# EAGLE design Four_Track_R1 (EAGLE 9.6.2)
TITLE: Four Track
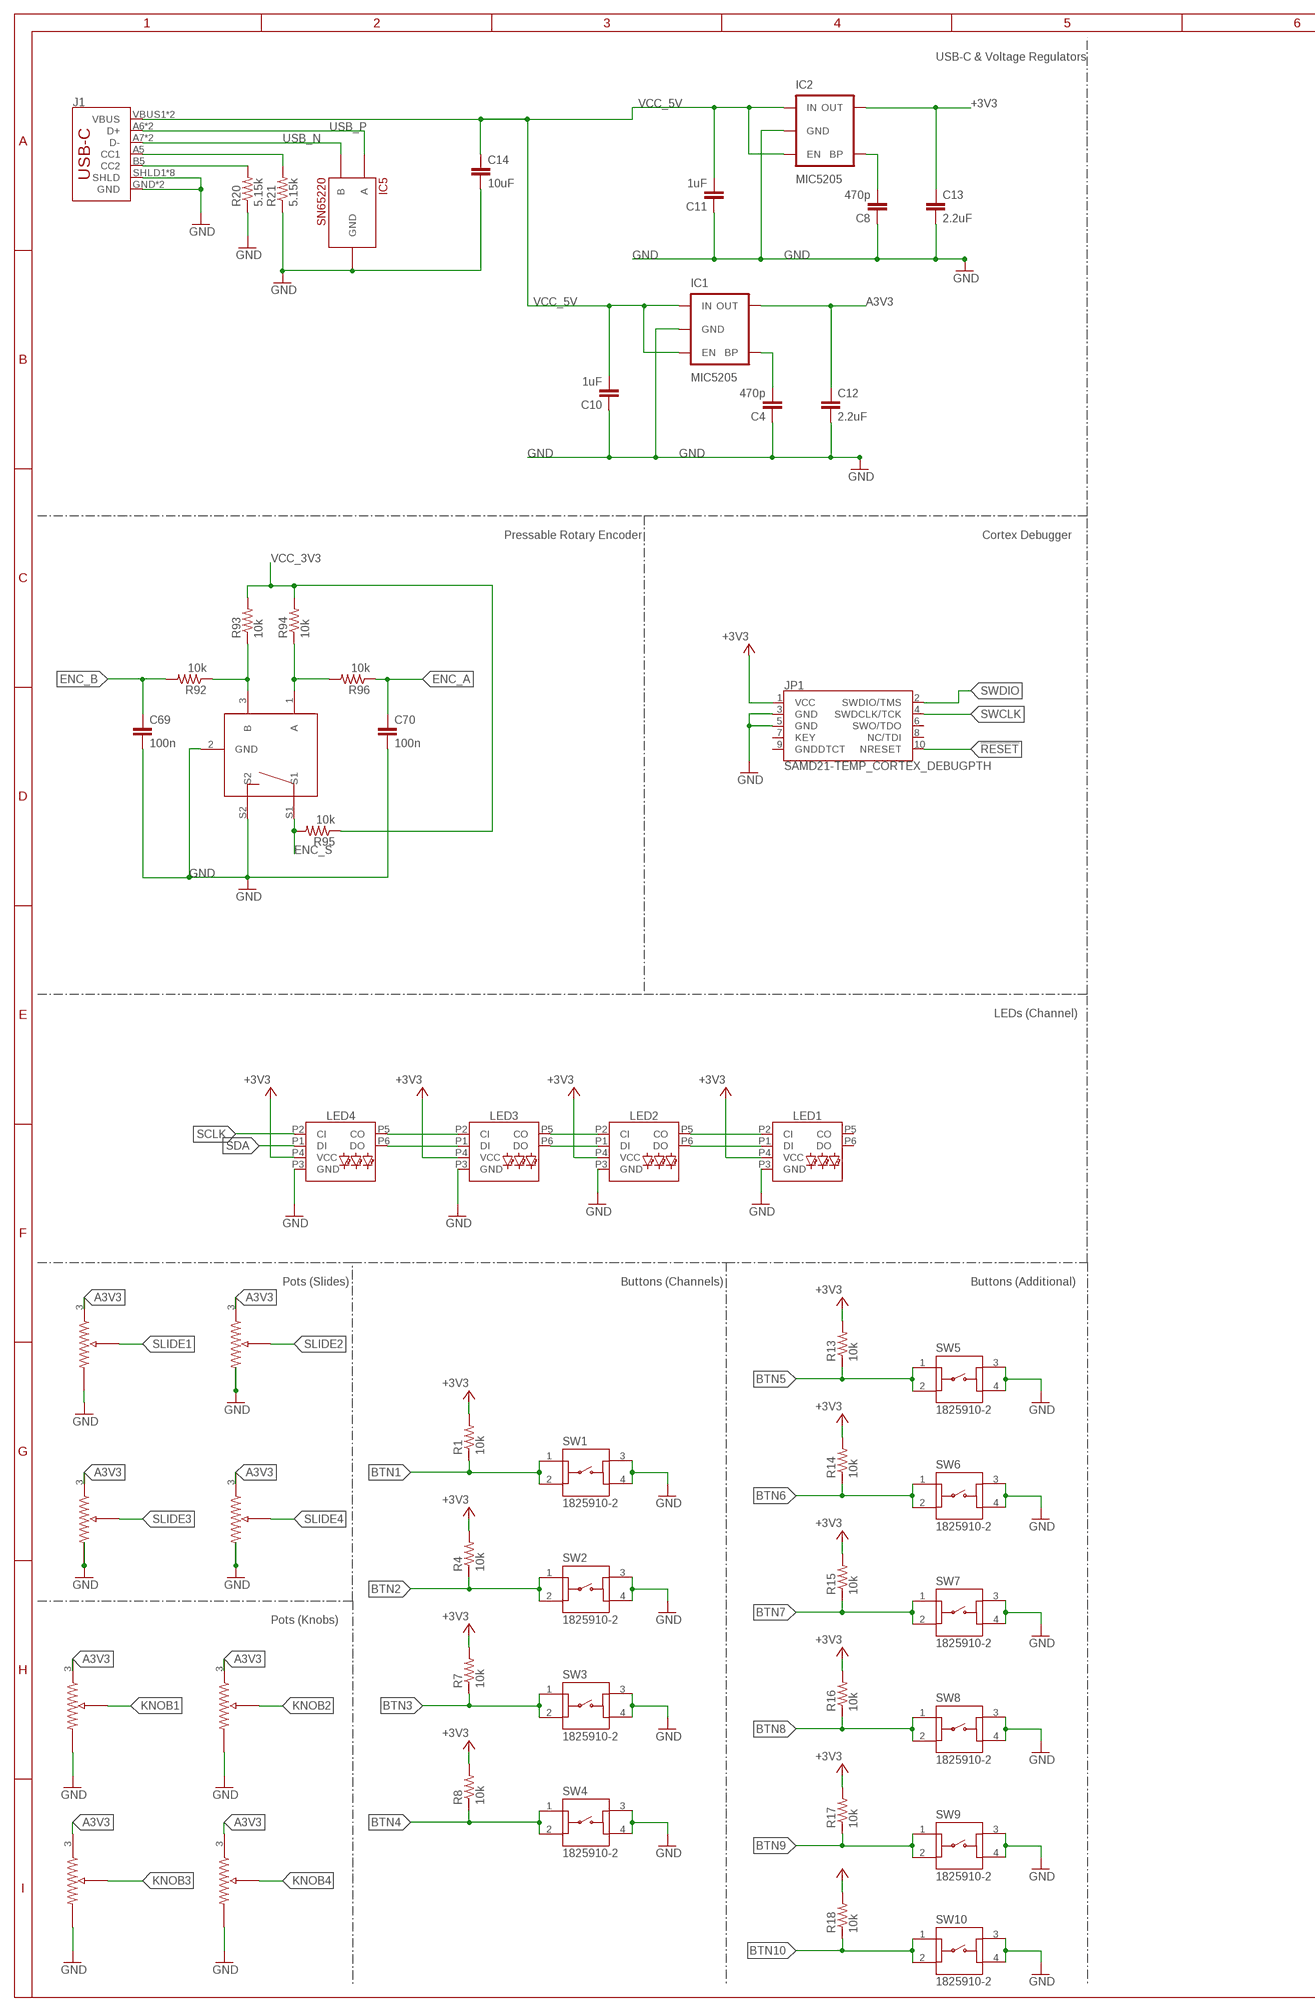
[diagram p0: schematic, sheet 1, part 1 of 2]
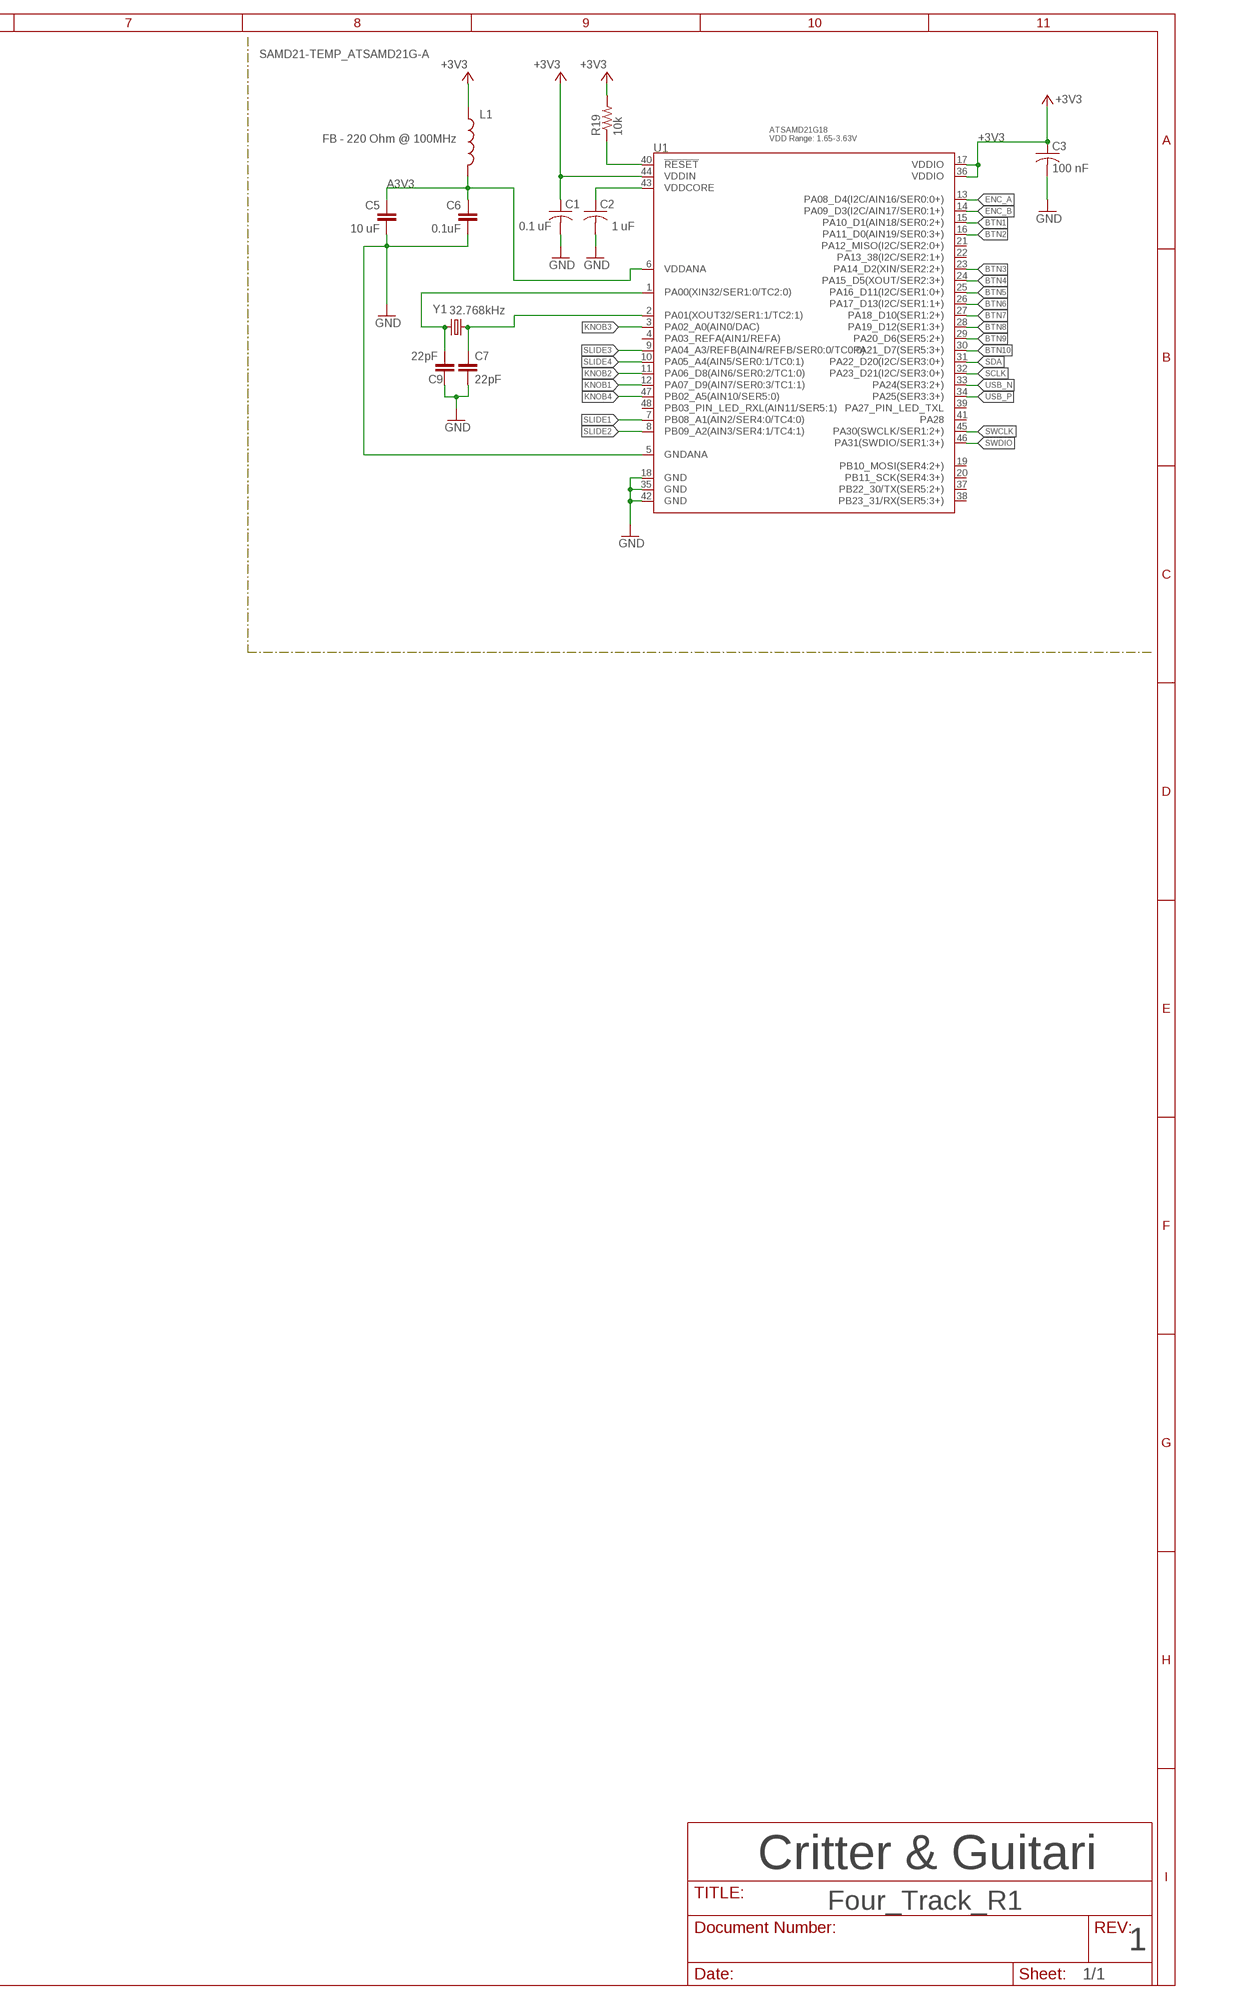
[diagram p1: schematic, sheet 1, part 2 of 2]

## Parts
C1  0.1 uF  C-USC0603  [C0603]
C2  1 uF  C-USC0603  [C0603]
C3  100 nF  C-USC0603  [C0603]
C4  470p  CAP0603-CAP  [0603-CAP]
C5  10 uF  0.1UF-25V(+80/-20%)(0603)  [0603-CAP]
C6  0.1uF  0.1UF-25V(+80/-20%)(0603)  [0603-CAP]
C7  22pF  15PF-50V-5%(0603)  [0603-CAP]
C8  470p  CAP0603-CAP  [0603-CAP]
C9  22pF  15PF-50V-5%(0603)  [0603-CAP]
C10  1uF  CAP0603-CAP  [0603-CAP]
C11  1uF  CAP0603-CAP  [0603-CAP]
C12  2.2uF  C-EUC0805  [C0805]
C13  2.2uF  C-EUC0805  [C0805]
C14  10uF  C-EUC1206  [C1206]
C69  100n  CAP0603-CAP  [0603-CAP]
C70  100n  CAP0603-CAP  [0603-CAP]
IC1  MIC5205  V_REG_LDOSMD  [SPARKFUN-3-2-07_SOT23-5]
IC2  MIC5205  V_REG_LDOSMD  [SPARKFUN-3-2-07_SOT23-5]
IC5  SN65220  [SOT23-6L]
J1  SPARKFUN-CONNECTORS_USB_C16PIN  [SPARKFUN-CONNECTORS_USB-C-16P]
JP1  SAMD21-TEMP_CORTEX_DEBUGPTH  [SAMD21-TEMP_2X5-PTH-1.27MM]
L1  FB - 220 Ohm @ 100MHz  INDUCTOR0603  [0603]
LED1  SPARKFUN-LED_APA102-5050  [SPARKFUN-LED_APA102-5050]
LED2  SPARKFUN-LED_APA102-5050  [SPARKFUN-LED_APA102-5050]
LED3  SPARKFUN-LED_APA102-5050  [SPARKFUN-LED_APA102-5050]
LED4  SPARKFUN-LED_APA102-5050  [SPARKFUN-LED_APA102-5050]
R1  10k  R-US_R0603  [R0603]
R2  POTPTA45  [SLIDE_POT_PTA4543]
R3  POTPTA45  [SLIDE_POT_PTA4543]
R4  10k  R-US_R0603  [R0603]
R5  POTPTA45  [SLIDE_POT_PTA4543]
R6  POTVERT  [POT-P09X-VERT]
R7  10k  R-US_R0603  [R0603]
R8  10k  R-US_R0603  [R0603]
R9  POTVERT  [POT-P09X-VERT]
R10  POTVERT  [POT-P09X-VERT]
R11  POTPTA45  [SLIDE_POT_PTA4543]
R12  POTVERT  [POT-P09X-VERT]
R13  10k  R-US_R0603  [R0603]
R14  10k  R-US_R0603  [R0603]
R15  10k  R-US_R0603  [R0603]
R16  10k  R-US_R0603  [R0603]
R17  10k  R-US_R0603  [R0603]
R18  10k  R-US_R0603  [R0603]
R19  10k  R-US_R0603  [R0603]
R20  5.15k  R-US_R0603  [R0603]
R21  5.15k  R-US_R0603  [R0603]
R92  10k  RESISTOR0603-RES  [0603-RES]
R93  10k  RESISTOR0603-RES  [0603-RES]
R94  10k  RESISTOR0603-RES  [0603-RES]
R95  10k  RESISTOR0603-RES  [0603-RES]
R96  10k  RESISTOR0603-RES  [0603-RES]
S3  ENCODER_SWITCH  [ENCODER_SWITCH]
SW1  1825910-2  [TE_1825910-2]
SW2  1825910-2  [TE_1825910-2]
SW3  1825910-2  [TE_1825910-2]
SW4  1825910-2  [TE_1825910-2]
SW5  1825910-2  [TE_1825910-2]
SW6  1825910-2  [TE_1825910-2]
SW7  1825910-2  [TE_1825910-2]
SW8  1825910-2  [TE_1825910-2]
SW9  1825910-2  [TE_1825910-2]
SW10  1825910-2  [TE_1825910-2]
U1  SAMD21-TEMP_ATSAMD21G-A  [SAMD21-TEMP_TQFP-48]
Y1  32.768kHz  CRYSTAL3.2X1.5MM  [CRYSTAL-SMD-3.2X1.5MM]

## Nets
!RESET: JP1.10(NRESET) R19.1 U1.40(!RESET!)
+3V3: C1.1 C3.1 C13.1 IC2.5(OUT) JP1.1(VCC) L1.1 LED1.P4(VCC) LED2.P4(VCC) LED3.P4(VCC) LED4.P4(VCC) R1.2 R4.2 R7.2 R8.2 R13.2 R14.2 R15.2 R16.2 R17.2 R18.2 R19.2 U1.17(VDDIO) U1.36(VDDIO) U1.44(VDDIN)
A3V3: C5.1 C6.1 C12.1 IC1.5(OUT) L1.2 R2.3 R3.3 R5.3 R6.3 R9.3 R10.3 R11.3 R12.3 U1.6(VDDANA)
BTN1 [Digital IO]: R1.1 SW1.1 SW1.2 U1.15(PA10_D1(AIN18/SER0:2+))
BTN2 [Digital IO]: R4.1 SW2.1 SW2.2 U1.16(PA11_D0(AIN19/SER0:3+))
BTN3 [Digital IO]: R7.1 SW3.1 SW3.2 U1.23(PA14_D2(XIN/SER2:2+))
BTN4: R8.1 SW4.1 SW4.2 U1.24(PA15_D5(XOUT/SER2:3+))
BTN5 [Digital IO]: R13.1 SW5.1 SW5.2 U1.25(PA16_D11(I2C/SER1:0+))
BTN6: R14.1 SW6.1 SW6.2 U1.26(PA17_D13(I2C/SER1:1+))
BTN7 [Digital IO]: R15.1 SW7.1 SW7.2 U1.27(PA18_D10(SER1:2+))
BTN8 [Digital IO]: R16.1 SW8.1 SW8.2 U1.28(PA19_D12(SER1:3+))
BTN9 [Digital IO]: R17.1 SW9.1 SW9.2 U1.29(PA20_D6(SER5:2+))
BTN10 [Digital IO]: R18.1 SW10.1 SW10.2 U1.30(PA21_D7(SER5:3+))
ENC_A: C70.1 R96.1 U1.13(PA08_D4(I2C/AIN16/SER0:0+))
ENC_B: C69.1 R92.2 U1.14(PA09_D3(I2C/AIN17/SER0:1+))
ENC_S: R95.2 S3.S1
GND: C1.2 C2.2 C3.2 C4.1 C5.2 C6.2 C7.2 C8.1 C9.1 C10.1 C11.1 C12.2 C13.2 C14.2 C69.2 C70.2 IC1.2(GND) IC2.2(GND) IC5.2(GND) IC5.5(GND) J1.GND J1.GND2(GND) J1.SHLD1(SHLD) J1.SHLD2(SHLD) J1.SHLD3(SHLD) J1.SHLD4(SHLD) J1.SHLD5(SHLD) J1.SHLD6(SHLD) J1.SHLD7(SHLD) J1.SHLD8(SHLD) JP1.3(GND) JP1.5(GND) LED1.P3(GND) LED2.P3(GND) LED3.P3(GND) LED4.P3(GND) R2.1 R3.1 R5.1 R6.1 R9.1 R10.1 R11.1 R12.1 R20.1 R21.1 S3.2(GND) S3.S2 SW1.3 SW1.4 SW2.3 SW2.4 SW3.3 SW3.4 SW4.3 SW4.4 SW5.3 SW5.4 SW6.3 SW6.4 SW7.3 SW7.4 SW8.3 SW8.4 SW9.3 SW9.4 SW10.3 SW10.4 U1.5(GNDANA) U1.18(GND) U1.35(GND) U1.42(GND)
KNOB1 [Digital IO]: R6.WIPER U1.12(PA07_D9(AIN7/SER0:3/TC1:1))
KNOB2 [Digital IO]: R12.WIPER U1.11(PA06_D8(AIN6/SER0:2/TC1:0))
KNOB3 [power]: R9.WIPER U1.3(PA02_A0(AIN0/DAC))
KNOB4 [power]: R10.WIPER U1.47(PB02_A5(AIN10/SER5:0))
N$1: J1.B5(CC2) R20.2
N$2: LED3.P2(CI) LED4.P5(CO)
N$3: LED3.P1(DI) LED4.P6(DO)
N$4: LED2.P1(DI) LED3.P6(DO)
N$5: LED2.P2(CI) LED3.P5(CO)
N$6: LED1.P1(DI) LED2.P6(DO)
N$7: LED1.P2(CI) LED2.P5(CO)
N$8: J1.A5(CC1) R21.2
N$9: C4.2 IC1.4(BP)
N$10: C8.2 IC2.4(BP)
N$11: C7.1 U1.2(PA01(XOUT32/SER1:1/TC2:1)) Y1.P$1
N$12: C9.2 U1.1(PA00(XIN32/SER1:0/TC2:0)) Y1.P$2
N$16: R92.1 R93.1 S3.3(B)
N$21: R94.1 R96.2 S3.1(A)
SCLK: LED4.P2(CI) U1.32(PA23_D21(I2C/SER3:0+))
SDA: LED4.P1(DI) U1.31(PA22_D20(I2C/SER3:0+))
SLIDE1 [power]: R11.2 U1.7(PB08_A1(AIN2/SER4:0/TC4:0))
SLIDE2 [power]: R5.2 U1.8(PB09_A2(AIN3/SER4:1/TC4:1))
SLIDE3 [power]: R2.2 U1.9(PA04_A3/REFB(AIN4/REFB/SER0:0/TC0:0))
SLIDE4 [power]: R3.2 U1.10(PA05_A4(AIN5/SER0:1/TC0:1))
SWCLK: JP1.4(SWDCLK/TCK) U1.45(PA30(SWCLK/SER1:2+))
SWDIO: JP1.2(SWDIO/TMS) U1.46(PA31(SWDIO/SER1:3+))
USB_N: IC5.4(B) J1.A7(D-) J1.B7(D-) U1.33(PA24(SER3:2+))
USB_P: IC5.6(A) J1.A6(D+) J1.B6(D+) U1.34(PA25(SER3:3+))
VCC_3V3: R93.2 R94.2 R95.1
VCC_5V: C10.2 C11.2 C14.1 IC1.1(IN) IC1.3(EN) IC2.1(IN) IC2.3(EN) J1.VBUS1(VBUS) J1.VBUS2(VBUS)
VDDCORE: C2.1 U1.43(VDDCORE)
Unconnected: JP1.6(SWO/TDO) JP1.7(KEY) JP1.8(NC/TDI) JP1.9(GNDDTCT) LED1.P5(CO) LED1.P6(DO) U1.4(PA03_REFA(AIN1/REFA)) U1.19(PB10_MOSI(SER4:2+)) U1.20(PB11_SCK(SER4:3+)) U1.21(PA12_MISO(I2C/SER2:0+)) U1.22(PA13_38(I2C/SER2:1+)) U1.37(PB22_30/TX(SER5:2+)) U1.38(PB23_31/RX(SER5:3+)) U1.39(PA27_PIN_LED_TXL) U1.41(PA28) U1.48(PB03_PIN_LED_RXL(AIN11/SER5:1))

## Notes on the sheet
- USB-C & Voltage Regulators
- ATSAMD21G18
  VDD Range: 1.65-3.63V
- Pressable Rotary Encoder | Cortex Debugger
- LEDs (Channel)
- Pots (Slides) | Buttons (Channels) | Buttons (Additional)
- Pots (Knobs)
- Critter & Guitari
- 1

## Library data of the parts
C1-C3 = rcl:C-US: CAPACITOR, American symbol; CID: 67; SPICEPREFIX: C
C4 C8 = osborn:CAP: Capacitor Standard 0603 ceramic capacitor, and 0.1" leaded capacitor.; CID: 111
C5 = SparkFun-Capacitors:0.1UF-25V(+80/-20%)(0603): CAP-00810 Ceramic Standard decoupling cap; CID: 366; PROD_ID: CAP-00810; VALUE: 0.1uF
C6 = SparkFun-Capacitors:0.1UF-25V(+80/-20%)(0603): CAP-00810 Ceramic Standard decoupling cap; CID: 67; PROD_ID: CAP-00810
C7 C9 = SparkFun-Capacitors:15PF-50V-5%(0603): CAP-07881; CID: 106; PROD_ID: CAP-07881; VALUE: 15pF
C10 C11 = osborn:CAP: Capacitor Standard 0603 ceramic capacitor, and 0.1" leaded capacitor.; CID: 73
C12-C14 = rcl:C-EU: CAPACITOR, European symbol; CID: 428; SPICEPREFIX: C
C69 C70 = osborn:CAP: Capacitor Standard 0603 ceramic capacitor, and 0.1" leaded capacitor.; CID: 67
IC1 IC2 = osborn:V_REG_LDO: Voltage Regulator LDO Standard 150mA LDO voltage regulator in SOT-23 layout. Micrel part MIC5205. BP (by-pass) pin is used to lower output noise with 470pF cap.; CID: 146
IC5 = osborn:SN65220; CID: 314
J1 = USB-C-Breakout:SPARKFUN-CONNECTORS_USB_C: USB Type C 16Pin Connector Super Speed pins not available on the 16-pin purely SMD connector so this part is best for USB 2.0 implementations. D1 and D2 are tied together enabling D+/- no matter which way the cable is plugged into the connector. The two channel configuration pins (CC1/2) are exposed. These are normally connected to ground via 5.1k resistors but can be reconfigured for high current/high power applications.; CID: 449; PROD_ID: CONN-14122
JP1 = Debugger:SAMD21-TEMP_CORTEX_DEBUG: Cortex Debug Connector Datasheet <http://infocenter.arm.com/help/topic/com.arm.doc.faqs/attached/13634/cortex_debug_connectors.pdf>; CID: 450
L1 = SparkFun-Passives:INDUCTOR: Inductors Basic Inductor/Choke - 0603 and 1206. Footprints are not proven and vary greatly between part numbers. INDUCTOR POWER 3.3UH 4.0A SMD 0.197" L x 0.197" W x 0.177" H (5.00mm x 5.00mm x 4.50mm); CID: 452; PROD_ID: RES-07859
LED1-LED4 = LED_APA102-2020:SPARKFUN-LED_APA102: APA102 Addressable RGB LED Used in manufacturing of various products at SparkFun Packages: 5050 2020 SparkFun Products: SparkFun Lumenati Boards <https://www.sparkfun.com/categories/405>; CID: 445; PROD_ID: DIO-13739
R1 R4 R7 R8 R13-R21 = rcl:R-US_: RESISTOR, American symbol; CID: 69; SPICEPREFIX: R
R2 R3 R5 R11 = osborn:POT; CID: 444
R6 R9 R10 R12 = osborn:POT; CID: 161
R92-R96 = osborn:RESISTOR: Resistor Basic schematic elements and footprints for 0603, 1206, and PTH resistors.; CID: 69; SUPPLIER: none
S3 = osborn:ENCODER_SWITCH; CID: 197; SPICEPREFIX: X
SW1-SW10 = Switches:1825910-2: SWITCH TACTILE SPST-NO 0.05A 24V Check prices <https://pricing.snapeda.com/parts/1825910-2/TE%20Connectivity/view-part?ref=eda>; AVAILABILITY: In Stock; CID: 446; COMMENT: 1825910-2; CONFIGURATION_POLE-THROW: Single Pole - Single Throw; CONTACT_CURRENT_RATING: 50 mA; DESCRIPTION: 50 mA SPST Round Actuator 160 Gram Force Tactile Pushbutton Switch; EU_ROHS_COMPLIANCE: Compliant; MF: TE Connectivity; MP: 1825910-2; PACKAGE: None; PRICE: None; PURCHASE-URL: https://pricing.snapeda.com/search/part/1825910-2/?ref=eda
U1 = sparkfun-samd21-pro-breakout-v10:SAMD21-TEMP_ATSAMD21G: Atmel SAMD21G SMART ARM-Based Microcontroller 7_21_21 Note: The symbo for the SAM21 has been updated to include added description for the Arduino pinout implementing the Sparkfun SAMD Board. The format is as follows: SAMDRegisterPin_ArduinoPin(Capabilities/Description); e.g. PB08_A5(AIN6/SER0:1/TC0:1). See https://cdn.sparkfun.com/assets/learn_tutorials/4/5/4/graphicalDatasheet-Dev.pdf The Atmel ® | SMART ™ SAM D21 is a series of low-power microcontrollers using the 32-bit ARM ® Cortex ® -M0+ processor, and ranging from 32- to 64-pins with up to 256KB Flash and 32KB of SRAM. The SAM D21 devices operate at a maximum frequency of 48MHz and reach 2.46 CoreMark/MHz. They are designed for simple and intuitive migration with identical peripheral modules, hex compatible code, identical linear address map and pin compatible migration paths between all devices in the product series. All devices include intelligent and flexible peripherals, Atmel Event System for inter-peripheral signaling, and support for capacitive touch button, slider and wheel user interfaces.; CID: 448; PROD_ID: IC-13064
Y1 = samd21-temp:CRYSTAL: Various standard crystals. Proven footprints.; CID: 451; PROD_ID: XTAL-13062

## Net classes
0 default: width 0.203 mm
1 power: width 0.203 mm

## Board
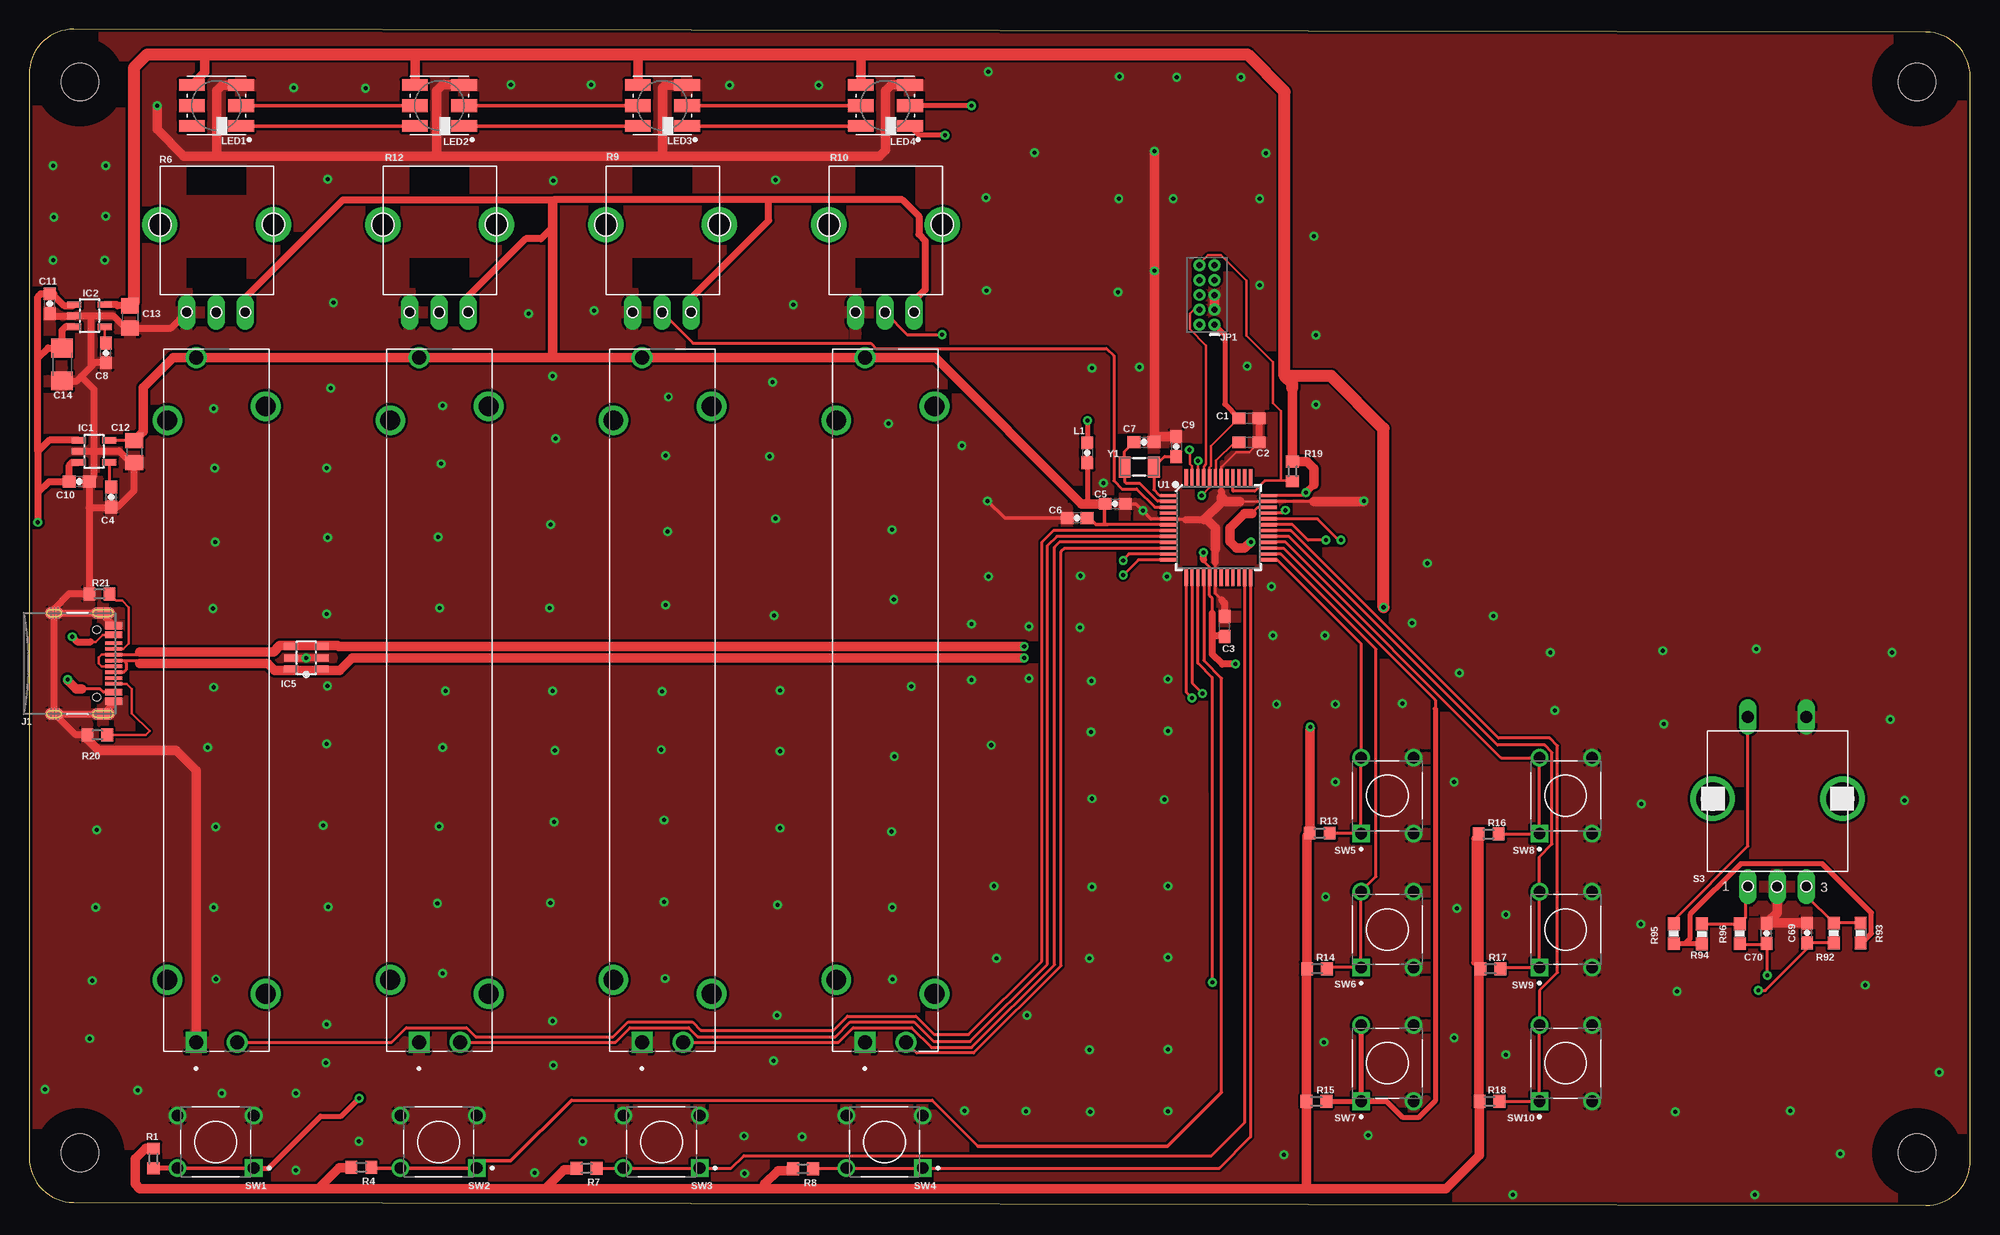
[diagram p2: board, top side]
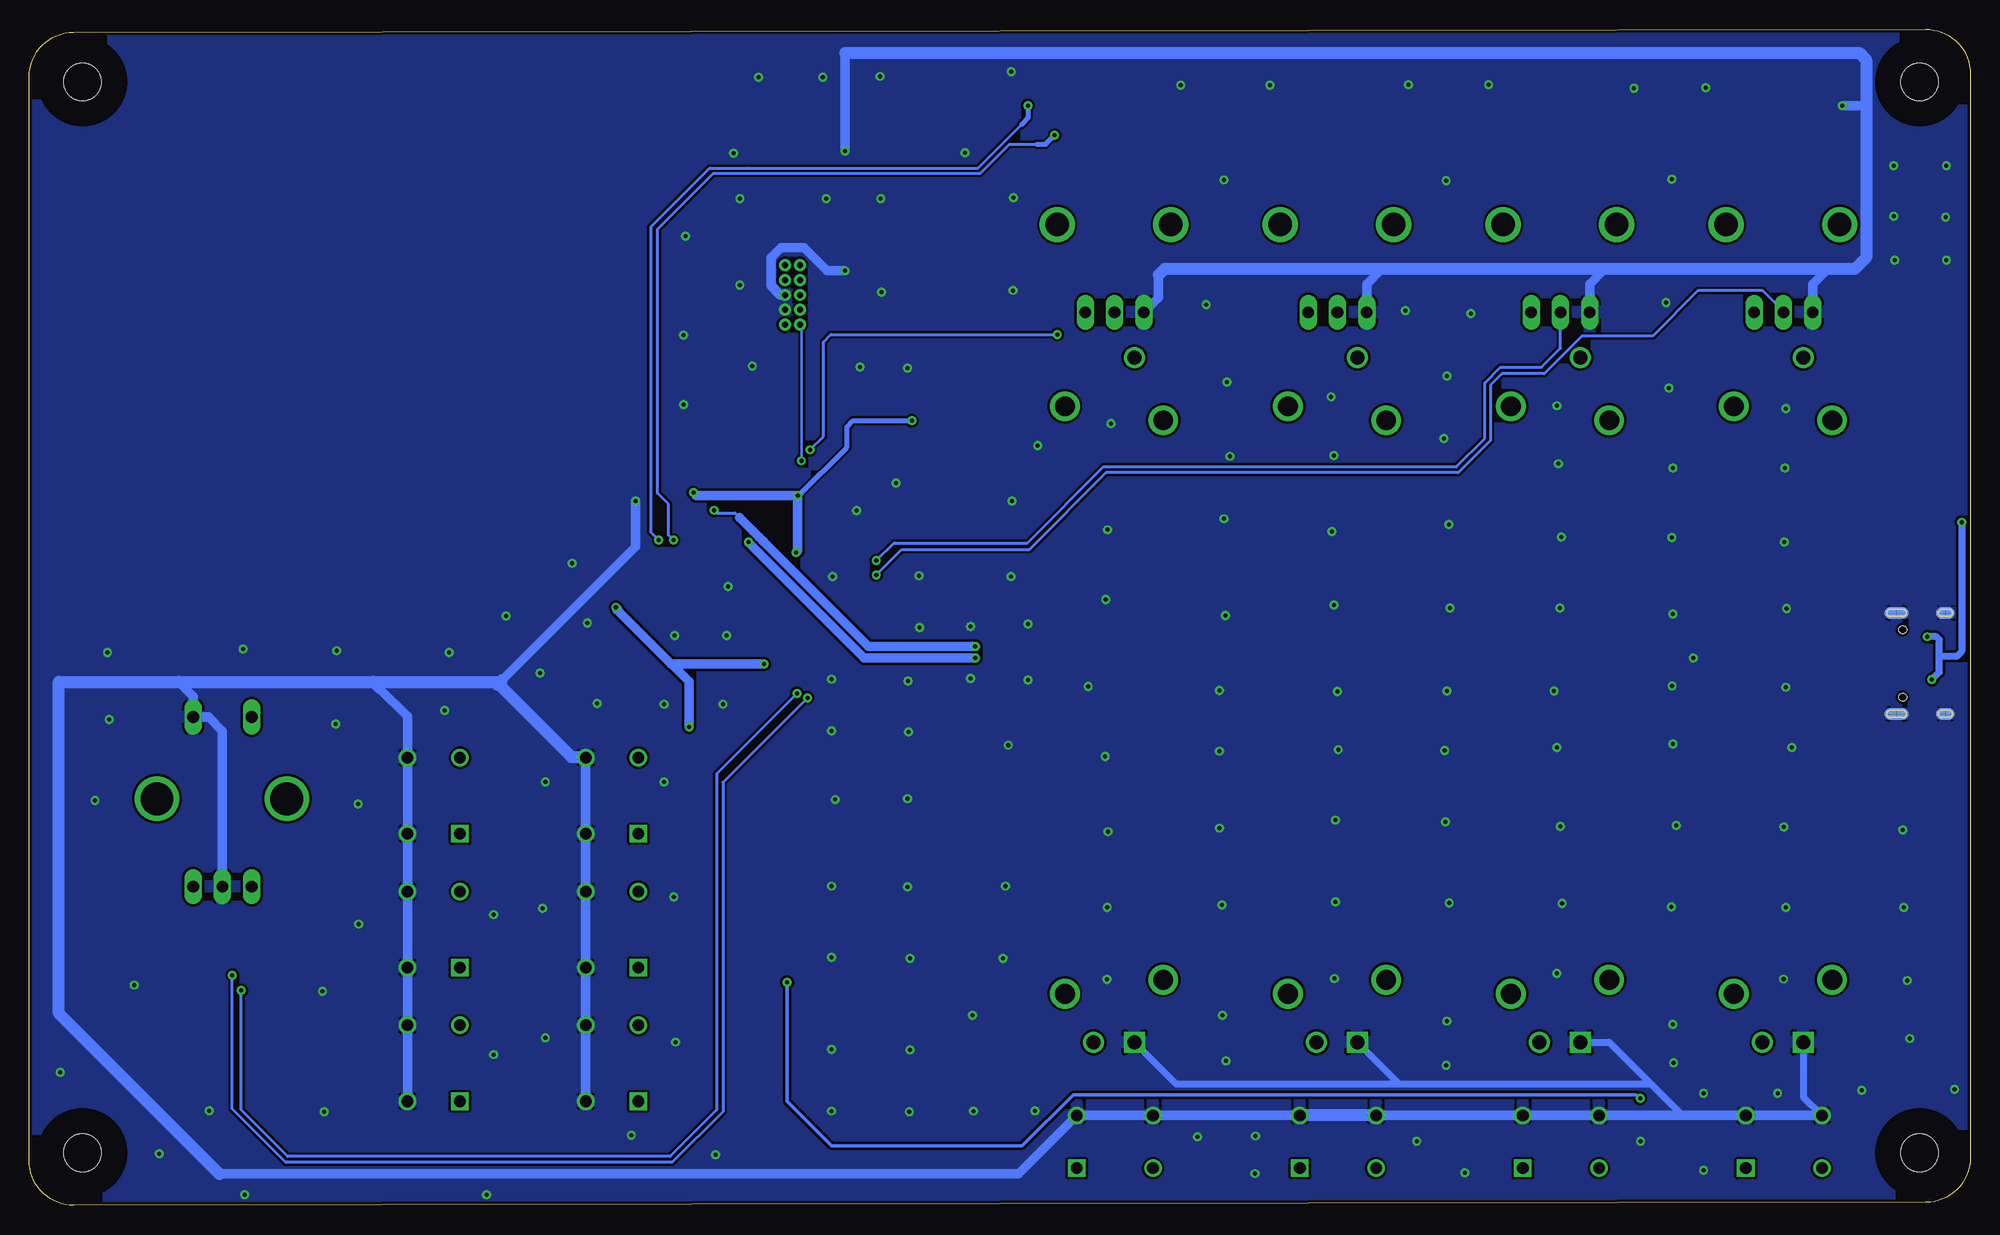
[diagram p3: board, bottom side, seen from below]

Size 165.84 x 100.5 mm. Coordinates in mm from the lower left corner, seen from the top.
Outline: 0,96.69 0,4.05 arc90 3.8,0.24 162.03,0 arc90 165.84,3.81 165.84,96.44 arc90 162.04,100.25 3.82,100.5 arc90 0,96.69
Copper layers (1*16): Top 0.035mm / dielectric 0.5mm / Bottom 0.035mm
Design rules "default *": minimum track width 8mil, minimum drill 0.35mm, track to track 8mil, track to pad 8mil, pad to pad 8mil, via to via 8mil, smd to smd 8mil, copper to edge 10mil, drill to drill 6mil, minimum pad ring 10mil, minimum via ring 8mil, stop-mask expansion 4mil, vias tented up to drill 0mil, thermal gap 8mil

### Footprints (pad centres in the part's own frame; a part is rotated, then mirrored left to right if it is on the bottom)
C0603 = smd 1.1 x 1: 1 -0.85,0; 2 0.85,0
0603-CAP = smd 1.1 x 1: 1 -0.85,0; 2 0.85,0
C0805 = smd 1.3 x 1.5: 1 -0.95,0; 2 0.95,0
C1206 = smd 1.6 x 1.8: 1 -1.4,0; 2 1.4,0
INSULATED_HOLE = hole 3.2: 0,0
SPARKFUN-3-2-07_SOT23-5 = smd 0.55 x 1.2: 1 -0.95,-1.3; 2 0,-1.3; 3 0.95,-1.3; 4 0.95,1.3; 5 -0.95,1.3
SOT23-6L = smd 0.6 x 1.2: 1 -0.95,-1.3; 2 0,-1.3; 3 0.95,-1.3; 4 0.95,1.3; 5 0,1.3; 6 -0.95,1.3
SPARKFUN-CONNECTORS_USB-C-16P = smd 0.3 x 1.45: A5 -1.25,0; A6 -0.25,0; A7 0.25,0; A8 1.25,0; B5 1.75,0; B6 0.75,0; B7 -0.75,0; B8 -1.75,0 | smd 0.6 x 1.45: GND -3.225,0; GND2 3.225,0 | smd 1 x 2.1: SHLD1 -4.32,-0.915; SHLD2 4.32,-0.915 | smd 1 x 2.1 bottom: SHLD3 -4.32,-0.915; SHLD4 4.32,-0.915 | smd 1 x 1.6: SHLD5 -4.32,-5.095; SHLD8 4.32,-5.095 | smd 1 x 1.6 bottom: SHLD6 -4.32,-5.095; SHLD7 4.32,-5.095 | smd 0.55 x 1.45: VBUS1 -2.45,0; VBUS2 2.45,0 | hole 0.65: -2.89,-1.445; 2.89,-1.445
SAMD21-TEMP_2X5-PTH-1.27MM = drill 0.508 pad 1: 1 -2.54,-0.635; 2 -2.54,0.635; 3 -1.27,-0.635; 4 -1.27,0.635; 5 0,-0.635; 6 0,0.635; 7 1.27,-0.635; 8 1.27,0.635; 9 2.54,-0.635; 10 2.54,0.635
0603 = smd 1.1 x 1: 1 -0.85,0; 2 0.85,0
SPARKFUN-LED_APA102-5050 = smd 1 x 2.2: P1 -1.75,-2.1; P3 1.75,-2.1; P4 1.75,2.1; P6 -1.75,2.1 | smd 1.1 x 2.2: P2 0,-2.1; P5 0,2.1
R0603 = smd 1 x 1.1: 1 -0.85,0; 2 0.85,0
SLIDE_POT_PTA4543 = drill 1.2 square: 1 -29.25,1.75 | drill 1.2: 2 -29.25,-1.75; 3 29.25,1.75 | drill 1.7: P1 -23.9,4.2; P2 23.9,4.2; P3 -25.1,-4.2; P4 25.1,-4.2
POT-P09X-VERT = drill 1 pad 1.27 long: 1 -2.54,-7.51; 3 2.46,-7.51; WIPER -0.04,-7.51 | drill 2 pad 2.54: P$4 4.86,-0.01; P$5 -4.84,-0.01
0603-RES = smd 1.1 x 1: 1 -0.85,0; 2 0.85,0
ENCODER_SWITCH = drill 1 pad 1.27 long: 1 -2.54,-7.51; 2 -0.04,-7.51; 3 2.46,-7.51; S1 -2.54,6.99; S2 2.46,6.99 | drill 2.8: P$4 5.56,-0.01; P$5 -5.54,-0.01
TE_1825910-2 = drill 0.99 square: 1 0,0 | drill 0.99: 2 6.5,0; 3 0,-4.5; 4 6.5,-4.5
SAMD21-TEMP_TQFP-48 = smd 1.5 x 0.28: 1 -4.25,2.75; 2 -4.25,2.25; 3 -4.25,1.75; 4 -4.25,1.25; 5 -4.25,0.75; 6 -4.25,0.25; 7 -4.25,-0.25; 8 -4.25,-0.75; 9 -4.25,-1.25; 10 -4.25,-1.75; 11 -4.25,-2.25; 12 -4.25,-2.75; 25 4.25,-2.75; 26 4.25,-2.25; 27 4.25,-1.75; 28 4.25,-1.25; 29 4.25,-0.75; 30 4.25,-0.25; 31 4.25,0.25; 32 4.25,0.75; 33 4.25,1.25; 34 4.25,1.75; 35 4.25,2.25; 36 4.25,2.75 | smd 0.28 x 1.5: 13 -2.75,-4.25; 14 -2.25,-4.25; 15 -1.75,-4.25; 16 -1.25,-4.25; 17 -0.75,-4.25; 18 -0.25,-4.25; 19 0.25,-4.25; 20 0.75,-4.25; 21 1.25,-4.25; 22 1.75,-4.25; 23 2.25,-4.25; 24 2.75,-4.25; 37 2.75,4.25; 38 2.25,4.25; 39 1.75,4.25; 40 1.25,4.25; 41 0.75,4.25; 42 0.25,4.25; 43 -0.25,4.25; 44 -0.75,4.25; 45 -1.25,4.25; 46 -1.75,4.25; 47 -2.25,4.25; 48 -2.75,4.25
CRYSTAL-SMD-3.2X1.5MM = smd 1 x 1.8: P$1 -1.25,0; P$2 1.25,0

### Placement (x,y rotation side)
C1  104.22,67.25 0 top
C2  104.22,65.2 0 top
C3  102.13,49.45 90 top
C4  7.01,60.52 90 top
C5  92.79,59.94 0 top
C6  89.53,58.72 180 top
C7  95.25,65.22 0 top
C8  6.55,72.84 90 top
C9  97.99,64.84 270 top
C10  4.27,61.84 180 top
C11  1.75,77.03 90 top
C12  8.97,64.41 270 top
C13  8.61,75.91 270 top
C14  2.79,71.85 270 top
C69  151.89,23.26 90 top
C70  148.44,23.24 90 top
H$1  [INSULATED_HOLE]  4.32,96.01 0 top
IC1  5.54,64.43 270 top
IC2  5.16,76.02 270 top
IC5  23.67,46.78 90 top
J1  7.21,46.3 270 top
JP1  100.63,77.79 90 top
L1  90.4,64.31 270 top
LED1  16,93.97 90 top
LED2  35.05,93.97 90 top
LED3  54.1,93.97 90 top
LED4  73.15,93.97 90 top
R1  10.62,4.01 90 top
R2  54.1,43.17 90 top
R3  73.15,43.17 90 top
R4  28.37,3.25 180 top
R5  35.05,43.17 90 top
R6  16,83.81 0 top
R7  47.62,3.17 180 top
R8  66.12,3.12 180 top
R9  54.1,83.81 0 top
R10  73.15,83.81 0 top
R11  16,43.17 90 top
R12  35.05,83.81 0 top
R13  110.26,31.79 180 top
R14  110.03,20.21 180 top
R15  109.98,8.88 180 top
R16  124.69,31.72 180 top
R17  124.84,20.21 180 top
R18  124.76,8.88 180 top
R19  107.92,62.71 90 top
R20  5.82,40.2 0 top
R21  5.99,52.24 0 top
R92  154.18,23.26 270 top
R93  156.46,23.26 270 top
R94  142.9,23.18 270 top
R95  140.51,23.21 90 top
R96  146.15,23.21 90 top
S3  149.38,34.74 0 top
SW1  19.18,3.17 180 top
SW2  38.23,3.17 180 top
SW3  57.28,3.17 180 top
SW4  76.33,3.17 180 top
SW5  113.79,31.74 90 top
SW6  113.79,20.31 90 top
SW7  113.79,8.88 90 top
SW8  129.03,31.74 90 top
SW9  129.03,20.31 90 top
SW10  129.03,8.88 90 top
U1  101.6,57.91 0 top
U$1  [INSULATED_HOLE]  4.32,4.49 0 top
U$2  [INSULATED_HOLE]  161.29,4.49 0 top
U$3  [INSULATED_HOLE]  161.29,96.01 0 top
Y1  94.84,63.09 0 top

### Tracks (layer width: path | path; a pad name or v marks a point on that pad's centre or on a via)
!RESET
  Top 0.203: JP1.10 100,80.45 100.73,81.17 101.83,81.17 103.99,79.01 103.99,74.33 106.25,72.07 106.25,68.54 106.94,67.86 106.94,61.97 106.88,61.91 | R19.1 107.87,61.91 106.88,61.91 | 106.88,61.91 105.59,61.91
  Top 0.254: U1.40 102.85,61.03 104.71,61.03 105.59,61.91
+3V3  (via drill 0.35)
  Top 0.203: 7.53,76.87 7.43,76.97 | v100.18,60.65 100.85,61.32 U1.44 100.85,63.05 100.98,63.18 100.98,64.87 C1.1 103.29,67.33
  Top 0.254: U1.36 108.86,60.66 v109.09,60.89 | 100.33,55.16 100.33,55.06 100.85,54.54 U1.17 100.85,52.12 101.09,51.87 101.09,50.61
  Top 0.305: 90.42,65.18 L1.1
  Top 0.406: v90.42,67.05 90.42,65.18 | JP1.1 102.16,74.37 102.16,68.46 103.29,67.33
  Top 0.508: R16.2 123.46,31.34 123.46,20.75 R17.2 123.99,8.96 R18.2 123.91,8.61
  Top 0.61: 109.41,40.6 109.58,40.76 v109.45,40.89 | C13.1 7.53,76.87 | 7.43,76.97 IC2.5 | 101.09,48.66 101.09,50.61 | v103.05,46.25 101.93,46.25 101.09,47.09 101.09,48.66 | C3.1 102.07,48.66 101.09,48.66 | v109.09,60.89 109.78,61.58 | 100.33,55.16 v100.33,55.77
  Top 0.813: R1.2 9.93,4.86 9.04,3.97 9.04,1.82 9.45,1.42 24.74,1.42 | 24.74,1.42 44.09,1.42 | 44.09,1.42 62.84,1.42 | 109.12,1.42 109.12,8.87 R15.2 109.12,8.9 109.12,20.15 R14.2 109.18,31.57 R13.2 109.41,40.6 | 14.99,98.34 14.99,96.81 LED1.P4 | LED2.P4 32.95,98.34 | LED3.P4 52,98.34 | LED4.P4 71.05,98.34 | 107.92,69.84 R19.2 109.16,63.56 109.78,62.94 109.78,61.58 | 109.12,1.42 121.06,1.42 123.91,4.28 123.91,8.61 | R16.2 123.84,8.96 R18.2 | 109.12,1.42 62.84,1.42 | R8.2 65.11,2.97 63.98,2.97 62.84,1.82 62.84,1.42 | R7.2 46.63,3.03 45.71,3.03 44.09,1.42 | R4.2 27.47,3.19 26.49,3.19 24.74,1.44 24.74,1.42
  Top 1.016: v115.72,51.1 115.72,66.39 111.25,70.86 107.26,70.86 | C13.1 8.94,77.2 8.94,97.2 10.08,98.34 14.99,98.34 32.95,98.34 52,98.34 71.05,98.34 104.06,98.34 107.26,95.14 107.26,70.86 | 107.92,69.84 107.92,70.2 107.26,70.86
  Bottom 0.203: v109.09,60.89 108.85,60.65 | 100.25,60.65 v100.18,60.65
  Bottom 0.254: v115.72,51.1 115.56,50.93
  Bottom 0.406: 100.18,60.57 95.99,64.76 95.99,66.52 95.45,67.05 v90.42,67.05
  Bottom 0.813: 115.56,50.93 115.63,50.86 111.02,46.25 110.95,46.25 | 110.95,46.25 109.45,44.75 v109.45,40.89 | 110.95,46.25 v103.05,46.25 | 108.85,60.65 100.25,60.65 | v100.33,55.77 100.18,55.93 100.18,60.57 v100.18,60.65
A3V3
  Top 0.254: U1.6 92.12,58.16 | C12.1 6.86,65.36 IC1.5
  Top 0.305: C6.1 90.49,58.82 91.15,58.16 91.87,58.16 | 92.12,58.16 91.87,58.16 | C5.1 91.87,59.87 91.87,58.16 | 90.4,60.27 90.73,59.94
  Top 0.406: L1.2 90.4,60.27
  Top 0.61: R6.3 18.46,77.56 26.8,85.9 44.6,85.9 44.7,85.8 44.82,85.91 63.19,85.91 | R12.3 37.51,77.69 42.42,82.6 43.71,82.6 44.7,83.59 | 63.19,85.91 63.19,84.15 56.56,77.52 R9.3 | 63.19,85.91 74.61,85.91 76,84.52 76,82.97 76.56,82.42 76.56,78.24 75.61,77.3 R10.3
  Top 0.813: 44.7,72.42 R5.3 R11.3 12.28,72.42 9.73,69.87 9.73,66.12 C12.1 | 44.7,72.42 R2.3 R3.3 77.43,72.42 89.92,59.94 90.73,59.94 C5.1 | 44.7,72.42 44.7,83.59 44.7,85.8
BTN1  (via drill 0.35)
  Top 0.254: U1.15 99.85,46.33 101.06,45.11 101.06,35.35 101.09,35.32 v101.09,19.04
  Top 0.305: SW1.2 SW1.1
  Top 0.406: R1.1 10.63,3.17 SW1.2 | SW1.1 20.44,3.17 24.88,7.61 26.67,7.61 v28.19,9.14
  Bottom 0.305: v101.09,19.04 101.09,8.88 97.28,5.07 81.03,5.07 76.64,9.46 28.57,9.46 28.48,9.36 28.42,9.36 v28.19,9.14
BTN2
  Top 0.254: 81.08,5.05 77.14,8.99 46.33,8.99 | 101.88,9.67 101.88,45.03 100.46,46.45 100.38,46.53 100.35,46.56 U1.16
  Top 0.305: R4.1 29.29,3.18 31.72,3.18 SW2.2 SW2.1 38.86,3.8 41.15,3.8 46.33,8.99 | 81.08,5.05 97.26,5.05 101.88,9.67
BTN3
  Top 0.254: R7.1 SW3.2 SW3.1 59.98,3.17 61.05,4.25 101.03,4.25 103.85,7.07 U1.23
BTN4
  Top 0.254: R8.1 69.78,3.12 SW4.2 SW4.1 101.68,3.17 104.35,5.84 U1.24
BTN5
  Top 0.254: R13.1 113.74,31.8 SW5.1 SW5.2 113.79,48 106.64,55.16 U1.25
BTN6
  Top 0.254: R14.1 110.98,20.31 SW6.1 SW6.2 115.06,28.08 115.06,47.52 106.93,55.65 U1.26
BTN7
  Top 0.254: U1.27 107.16,56.16 120.14,43.17 120.14,42.44
  Top 0.406: SW7.2 SW7.1 | R15.1 SW7.1 | 120.14,42.44 120.14,8.92 118.75,7.53 117.33,7.53 115.97,8.88 SW7.1
BTN8
  Top 0.254: R16.1 125.56,31.74 SW8.1 SW8.2 125.76,38.24 107.34,56.66 U1.28
BTN9
  Top 0.254: R17.1 125.79,20.31 SW9.1 SW9.2 129.03,29.78 130.11,30.86 130.11,38.69 129.48,39.32 125.44,39.32 107.61,57.16 U1.29
BTN10
  Top 0.254: R18.1 SW10.1 SW10.2 129.03,18.35 130.57,19.89 130.57,39.26 129.91,39.92 125.53,39.92 107.79,57.66 U1.30
ENC_A  (via drill 0.35)
  Top 0.254: U1.13 98.85,43.86 v99.35,43.36 | R96.1 146.15,22.24 148.3,22.24 C70.1 148.49,22.33 v148.49,19.65
  Bottom 0.254: v99.35,43.36 106.58,36.13 106.58,8 110.92,3.65 143.92,3.65 148.49,8.22 v148.49,19.65
ENC_B  (via drill 0.35)
  Top 0.254: U1.14 99.35,44.64 v100.25,43.73 | R92.2 C69.1 151.89,21.91 148.34,18.36 v147.73,18.36
  Bottom 0.254: v100.25,43.73 107.11,36.88 107.11,8.15 111.07,4.19 143.76,4.19 147.73,8.15 v147.73,18.36
ENC_S
  Top 0.254: S3.S1 146.84,30.69 140.51,24.36 R95.2
GND  (via drill 0.35)
  Top 0.203: R21.1 5.02,52.36 | 2.12,50.82 J1.SHLD6 | 3.82,75.98 IC2.2 3.9,75.98 | U1.18 101.35,54.93 | C11.1 1.95,75.98 | C13.2 8.23,74.97 | U1.42 101.88,62.19 101.88,63.09 103.16,64.37 104.25,64.37 105.07,65.18 | C2.2 C1.2 | U1.35 103.45,60.16 | U1.42 101.85,61.03
  Top 0.254: 4.67,64.43 IC1.2 | U1.18 101.35,52.26 101.87,51.75 | 109.78,60.16 U1.35 | 95.85,58.66 U1.5 98.74,58.66 98.81,58.59 | C70.2 148.46,24.11 | U1.42
  Top 0.305: 95.85,58.66 v95.15,59.35 94.56,59.94 C5.2 | C6.2 83.36,58.72 v81.89,60.19
  Top 0.61: R21.1 3.39,52.24 2.12,50.97 2.12,50.82 | J1.GND 6.3,50.44 J1.SHLD3 J1.SHLD6 J1.SHLD7 | J1.SHLD7 J1.SHLD4 7.21,42.89 J1.GND2 | R20.1 3.98,40.2 2.18,41.99 2.1,41.99 J1.SHLD7 | IC5.5 23.62,46.78 | 23.62,46.78 v23.65,46.76 | IC5.2 23.62,46.78 | C13.2 12.12,74.97 R6.1 | C3.2 102.13,51.48 101.87,51.75 | 1.95,75.98 3.82,75.98 | 8.23,74.97 7.22,75.98 5.16,75.98 | 5.16,75.98 3.9,75.98 | C14.2 4.06,70.45 4.43,70.82 | C8.1 5.6,71.99 5.3,71.69 | 4.43,70.82 5.3,71.69 | 5.3,71.69 5.3,75.84 5.16,75.98 | 5.54,64.46 4.7,64.46 4.67,64.43 | 5.54,64.46 5.54,62.33 5.12,61.91 C10.1 5.12,59.58 | 5.54,64.46 5.54,69.72 4.43,70.82 | 5.12,59.58 5.12,52.46 5.02,52.36 | 8.97,63.16 8.97,61.1 7.54,59.67 C4.1 6.92,59.58 5.12,59.58 | 8.97,63.16 C12.2 | C1.2 105.07,65.18 | 101.35,54.93 101.35,56.08 | 101.85,61.03 101.85,60.5 | 8.97,63.16 7.67,64.46 5.54,64.46 | 98.81,58.59 100.39,58.59
  Top 0.813: v10.92,93.97 10.92,91.94 13.21,89.66 15.75,89.66 | 15.75,89.66 16,89.91 16,95.24 16.48,95.72 LED1.P3 | 15.75,89.66 34.8,89.66 | 34.8,89.66 54.1,89.66 | 54.1,89.66 72.64,89.66 73.15,90.16 73.15,95.24 73.66,95.75 75.22,95.75 LED4.P3 | LED2.P3 37.12,95.75 35.31,95.75 34.8,95.24 34.8,89.66 | LED3.P3 54.33,95.72 54.1,95.5 54.1,89.66 | 103.45,60.16 102.2,60.16 101.85,60.5 101.85,60.06 100.39,58.59 100.64,58.59 101.35,57.88 101.35,56.08 | R20.1 5,40.17 5,39.8 5.93,38.87 12.54,38.87 14.25,37.15 R11.1 | 148.46,24.11 C69.2 | C70.2 149.34,24.99 S3.2 | C9.1 96.57,65.69 C7.2 96.14,65.26 v96.14,79.85 v96.14,90.06 | JP1.3 JP1.5 | v114.02,60.2 113.98,60.16 109.78,60.16
  Bottom 0.61: SW1.4 14.25,9.24 R11.1 | R5.1 30.84,13.92 27.29,10.37 | R2.1 48.8,10.37 | 48.8,10.37 27.29,10.37 | R3.1 67.85,10.37 48.8,10.37 | 27.29,10.37 24.59,7.67
  Bottom 0.813: R12.1 32.51,78.73 31.24,80 | 50.29,80 51.56,78.73 R9.1 | SW1.4 SW1.3 24.59,7.67 SW2.4 SW2.3 SW3.4 | 12.19,80 13.46,78.73 R6.1 | 149.61,2.69 81.31,2.69 SW4.3 SW4.4 SW3.3 | 8.89,93.97 v10.92,93.97 | SW5.4 SW5.3 SW6.4 SW6.3 SW7.4 SW7.3 | SW10.3 SW10.4 SW9.3 SW9.4 SW8.3 SW8.4 133.53,41.76 135.94,44.17 135.94,44.24 136.4,44.7 | R10.1 69.34,77.57 69.34,79.5 | 125.85,44.48 125.47,44.87 114.02,56.31 v114.02,60.2 | 96.14,98.47 v96.14,90.06 | S3.2 149.34,40.54 150.53,41.73 S3.S2 151.84,43.5 153.06,44.72 | v96.14,79.85 97.68,79.85 99.66,81.83 101.61,81.83 102.46,80.98 102.46,78.58 101.68,77.79 JP1.5
  Bottom 1.016: 96.14,98.47 9.5,98.47 8.89,97.86 8.89,93.97 8.89,81 9.88,80 12.19,80 31.24,80 50.29,80 68.83,80 69.34,79.5 | 149.61,2.69 163.32,16.4 163.32,44.72 153.06,44.72 136.42,44.72 135.94,44.24 | SW3.4 SW3.3 | 136.4,44.7 125.63,44.7 125.47,44.87 | SW5.4 118.35,38.3 119.51,38.3 125.69,44.48 125.85,44.48
  other vias: 25.76,69.84 25.4,63.01 25.4,50.54 25.53,25.5 15.95,19.32 15.75,25.44 15.93,32.33 15.24,39.11 15.7,51 15.85,63.01 15.75,68.07 35.31,68.32 35.2,63.37 34.95,57.09 35.05,51.05 35.56,43.94 35.31,39.11 34.87,25.8 35.31,19.81 44.7,15.74 44.53,25.83 44.91,38.88 44.7,43.94 44.45,51.05 44.55,58.19 44.96,65.53 44.7,70.86 25.98,77.13 6.53,84.53 48.26,76.45 25.5,87.67 22.61,95.5 28.73,95.47 41.15,95.75 48.01,95.75 59.84,95.7 67.46,95.7 63.75,87.62 42.67,76.19 65.28,76.96 81.79,78.18 54.61,69.08 54.36,64.05 54.53,57.58 54.36,51.3 54.08,43.91 54.23,25.93 54.33,19.37 63.91,16.22 63.93,25.67 64.14,38.81 64.16,43.99 63.63,50.41 63.75,58.67 63.25,64 63.5,70.35 73.41,66.8 73.71,57.73 73.86,51.76 75.36,44.34 73.91,38.35 73.74,25.44 73.76,19.3 61.06,5.91 61.11,2.71 43.18,2.79 22.78,2.99 16.46,9.57 22.78,9.57 85.17,8.05 97.28,8.05 90.6,13.28 81.94,96.87 93.14,96.46 85.88,89.94 107.19,4.31 114.4,5.99 137.69,24.02 85.42,45.03 85.42,49.45 89.76,49.37 90.75,44.8 25.48,44.37 80.52,49.68 80.52,44.88 25.4,39.41 5.77,32.07 5.69,25.44 5.38,19.2 5.16,14.24 1.35,9.9 9.27,9.82 44.78,11.96 25.43,15.46 25.35,12.19 63.6,12.34 82.65,21.1 82.42,27.27 82.19,39.31 90.73,40.46 97.28,40.53 90.8,34.74 96.98,34.67 90.8,27.2 97.28,27.27 90.58,21.1 97.28,21.18 85.24,16.22 97.28,13.33 89.81,53.79 81.97,53.72 79.68,64.92 2.03,88.84 6.53,88.84 2.11,84.42 2.03,80.77 6.45,80.77 44.78,87.55 93.09,86.02 93.01,78.02 140.79,18.28 156.87,18.82 150.47,8.07 140.64,8 154.74,4.41 106.12,52.88 106.27,48.69 110.69,48.69 97.21,53.72 97.28,44.95 90.65,8 79.91,8.07 126.77,0.91 147.42,0.91 163.2,11.35 139.65,41.14 159,41.52 130.35,42.29 121.74,36.19 121.97,25.37 121.74,14.32 106.58,42.82 98.04,96.39 103.53,96.39 105.66,89.91 105.13,86.02 97.74,86.02 105.13,78.63 109.78,82.82 109.93,74.37 109.93,68.42 90.8,71.55 81.74,86.1 137.74,34.28 160.22,34.59 66.04,5.86 47.29,5.48 28.17,5.48 118.16,49.75 122.2,45.49 117.32,42.89 111.61,42.82 111.61,36.19 110.77,26.36 110.62,13.94 126.16,12.87 126.16,24.84 129.97,47.24 139.57,47.39 147.57,47.54 159.16,47.24 119.46,54.86 125.09,50.36 91.8,61.72 104.06,71.7 94.84,71.62 54,38.93 15.75,44.27 25.5,57.07 15.9,56.69 25.12,32.46 35.03,32.38 44.86,32.76 54.23,32.91 64.14,32.23 73.66,31.92
  pour Bottom: -21.08,103.63 173.23,103.63 173.23,-6.1 -21.08,-6.1
  pour Top: -22.61,-10.67 183.9,-10.67 183.9,108.45 174.75,108.45 -22.61,108.45
KNOB1  (via drill 0.35)
  Top 0.254: U1.12 94.76,55.16 v93.47,53.87
  Bottom 0.254: R6.WIPER 15.96,76.4 17.73,78.17 23.26,78.17 27.14,74.29 33.18,74.29 36.41,71.06 40,71.06 41,70.07 41,65.36 43.75,62.6 73.83,62.6 80.4,56.03 91.31,56.03 v93.47,53.87
KNOB2  (via drill 0.35)
  Top 0.254: U1.11 93.96,55.65 93.47,55.16 v93.47,55.09
  Bottom 0.254: v93.47,55.09 91.95,56.61 80.54,56.61 74.04,63.12 43.89,63.12 41.48,65.53 41.48,70.28 40.13,71.62 36.63,71.62 35.01,73.24 R12.WIPER
KNOB3
  Top 0.254: R9.WIPER 56.71,73.65 71.91,73.65 72.34,73.22 92.03,73.22 92.66,72.59 92.66,61.92 93.36,61.22 94.62,61.22 96.18,59.66 U1.3
KNOB4  (via drill 0.35)
  Top 0.203: U1.47 99.35,63.18 99.19,63.34 99.19,64.51 v99.14,64.56
  Top 0.254: R10.WIPER 75.05,74.37 78,74.37 v78,74.42
  Bottom 0.254: v99.14,64.56 97.99,65.7 97.99,73.78 97.36,74.42 v78,74.42
N$1
  Top 0.203: R20.2 9.96,40.2 10.27,40.52 8.76,42.03 8.76,44.12 8.34,44.55 J1.B5
N$2
  Top 0.305: LED4.P5 LED3.P2
N$3
  Top 0.305: LED4.P6 LED3.P1
N$4
  Top 0.305: LED3.P6 LED2.P1
N$5
  Top 0.305: LED3.P5 LED2.P2
N$6
  Top 0.305: LED2.P6 LED1.P1
N$7
  Top 0.254: 18.29,93.97 LED1.P2
  Top 0.305: LED2.P5 18.29,93.97
N$8
  Top 0.203: R21.2 7.41,51.68 7.92,51.68 8.5,51.1 8.5,48.02 8.02,47.55 J1.A5
N$9
  Top 0.254: IC1.4 6.84,61.55 C4.2
N$10
  Top 0.203: C8.2 6.46,73.79 IC2.4
N$11
  Top 0.254: U1.2 96.41,60.16 94.89,61.68 93.78,61.68 93.59,61.86 Y1.P$1 93.59,64.42 C7.1
N$12
  Top 0.254: U1.1 96.59,60.66 96.09,61.15 Y1.P$2 97,63.99 C9.2
N$16
  Top 0.254: R93.1 R92.1 151.84,26.45 S3.3
N$21
  Top 0.254: R94.1 142.93,24.06 R96.2 146.61,24.52 146.61,27 S3.1
SCLK  (via drill 0.35)
  Top 0.254: U1.32 110.06,58.65 111.88,56.84 v112.06,56.84
  Top 0.406: v80.52,93.97 LED4.P2
  Bottom 0.254: v112.06,56.84 112.75,57.53 112.75,83.59 107.69,88.64 104.44,88.64 84.78,88.64 81.06,92.36
  Bottom 0.406: v80.52,93.97 80.49,93.95 80.49,92.93 81.06,92.36
SDA  (via drill 0.35)
  Top 0.254: v110.8,56.84 109.26,56.84 107.95,58.15 U1.31
  Top 0.406: v78.23,91.43 76.04,91.43 LED4.P1
  Bottom 0.254: v110.8,56.84 111.23,57.27 111.23,59.9 112.17,60.85 112.17,83.4 107.39,88.19 84.59,88.19 82.1,90.67 79.76,90.67
  Bottom 0.406: 79.76,90.67 78.99,90.67 v78.23,91.43
SLIDE1
  Top 0.254: U1.7 87.5,57.66 86.51,56.67 86.51,20.85 80.26,14.6 77.31,14.6 75.76,16.15 69.9,16.15 68.7,14.95 57.37,14.95 56.66,15.66 51.17,15.66 49.9,14.4 38.15,14.4 37.37,15.18 32.21,15.18 30.95,13.92 R11.2
SLIDE2
  Top 0.254: R5.2 50.08,13.92 51.34,15.18 56.34,15.18 57.11,14.41 68.89,14.41 70.14,15.66 75.59,15.66 77.27,13.99 80.38,13.99 87,20.61 87,56.36 87.79,57.16 U1.8
SLIDE3
  Top 0.254: U1.9 88.02,56.66 87.61,56.24 87.61,20.56 80.52,13.48 77.09,13.48 75.39,15.18 70.39,15.18 69.13,13.92 R2.2
SLIDE4
  Top 0.254: R3.2 75.82,13.01 80.7,13.01 88.17,20.47 88.17,55.85 88.47,56.16 U1.10
SWCLK
  Top 0.203: JP1.4 99.51,76.52 99.16,76.18 99.16,74.87 100.56,73.48 100.56,63.34 100.35,63.13 U1.45
SWDIO  (via drill 0.35)
  Top 0.203: U1.46 99.85,63.6 v99.87,63.62
  Bottom 0.203: v99.87,63.62 99.85,63.62 99.85,75.1 JP1.2
USB_N  (via drill 0.35)
  Top 0.203: J1.A7 6.19,46.05 5.94,46.3 5.94,46.81 6.19,47.05 J1.B7
  Top 0.254: IC5.4 22.08,47.73 22,47.81 | v107.34,59.39 107.11,59.16 U1.33 | 9.42,47.28 9.19,47.05 J1.B7
  Top 0.813: 9.42,47.28 20.88,47.28 21.41,47.81 22,47.81 26.36,47.81 26.44,47.74 v85.01,47.74
  Bottom 0.254: 103.07,56.69 103.19,56.8 | v107.34,59.39 107.11,59.16 105.54,59.16 105.17,58.78 104.01,57.62
  Bottom 0.813: v85.01,47.74 94.12,47.74 103.07,56.69 | 103.19,56.8 103.43,57.05 103.43,57.08 103.98,57.62 | 104.01,57.62 103.98,57.62 | 103.98,57.62 105.14,58.78 105.17,58.78
USB_P  (via drill 0.35)
  Top 0.254: IC5.6 21.89,45.83 21.77,45.71 | 104.45,59.12 104.98,59.65 U1.34 | J1.B6 7.21,45.57 8.07,45.57 8.27,45.76 8.27,46.34 8.06,46.55 | J1.A6 8.06,46.55 | 8.06,46.55 9.21,46.55 9.42,46.33 9.42,46.32
  Top 0.813: 104.45,59.12 103.84,59.12 102.58,57.86 102.58,56.7 103.12,56.15 103.83,56.15 v104.37,56.69 | 9.42,46.32 20.37,46.32 20.98,45.71 21.77,45.71 26.52,45.71 27.58,46.77 v85.01,46.77
  Bottom 0.254: 104.37,56.62 v104.37,56.69
  Bottom 0.813: v85.01,46.77 94.52,46.77 104.37,56.62
VCC_3V3
  Top 0.406: R95.1 141.48,22.36 | 141.48,22.36 142.88,22.36 R94.2 | R93.2 156.59,22.41 157.4,23.22 157.4,25 153.21,29.18 146.22,29.18 141.89,24.85 141.89,22.77 141.48,22.36
VCC_5V  (via drill 0.35)
  Top 0.203: 3.77,76.88 IC2.1 | J1.VBUS1 6.29,48.75 5.69,48.15 5.23,48.15
  Top 0.254: J1.VBUS2 6.33,43.85 6.06,44.11 4.47,44.11 | 3.28,44.85 v3.28,44.93
  Top 0.406: 2.13,77.88 C11.2
  Top 0.61: 0.74,64.41 0.74,72.38 | 0.74,64.41 1.71,65.38 IC1.1 | 0.74,64.41 0.74,60.89 | 0.74,60.89 v0.74,58.36 | 0.74,60.89 1.69,61.84 C10.2 3.42,63.25 3.65,63.48 IC1.3 | 0.74,72.38 0.74,77.64 0.98,77.88 2.13,77.88 | 0.74,72.38 1.6,73.25 C14.1 2.79,74.75 3.11,75.07 IC2.3 | C11.2 1.94,77.88 2.95,76.88 3.77,76.88 | 5.23,48.15 4.09,48.15 v3.66,48.58
  Top 0.813: 3.28,44.85 4.01,44.11 4.47,44.11
  Bottom 0.61: v3.28,44.93 2.64,45.56 2.64,46.93 | 2.64,46.93 2.64,48.33 2.9,48.58 v3.66,48.58 | 2.64,46.93 1.12,46.93 0.74,47.31 v0.74,58.36
VDDCORE
  Top 0.203: U1.43 101.39,62.2 101.39,63.63 102.95,65.2 C2.1